# Altium schematic sheet display.SchDoc
size A4; SheetNumber: 1; SheetTotal: 1
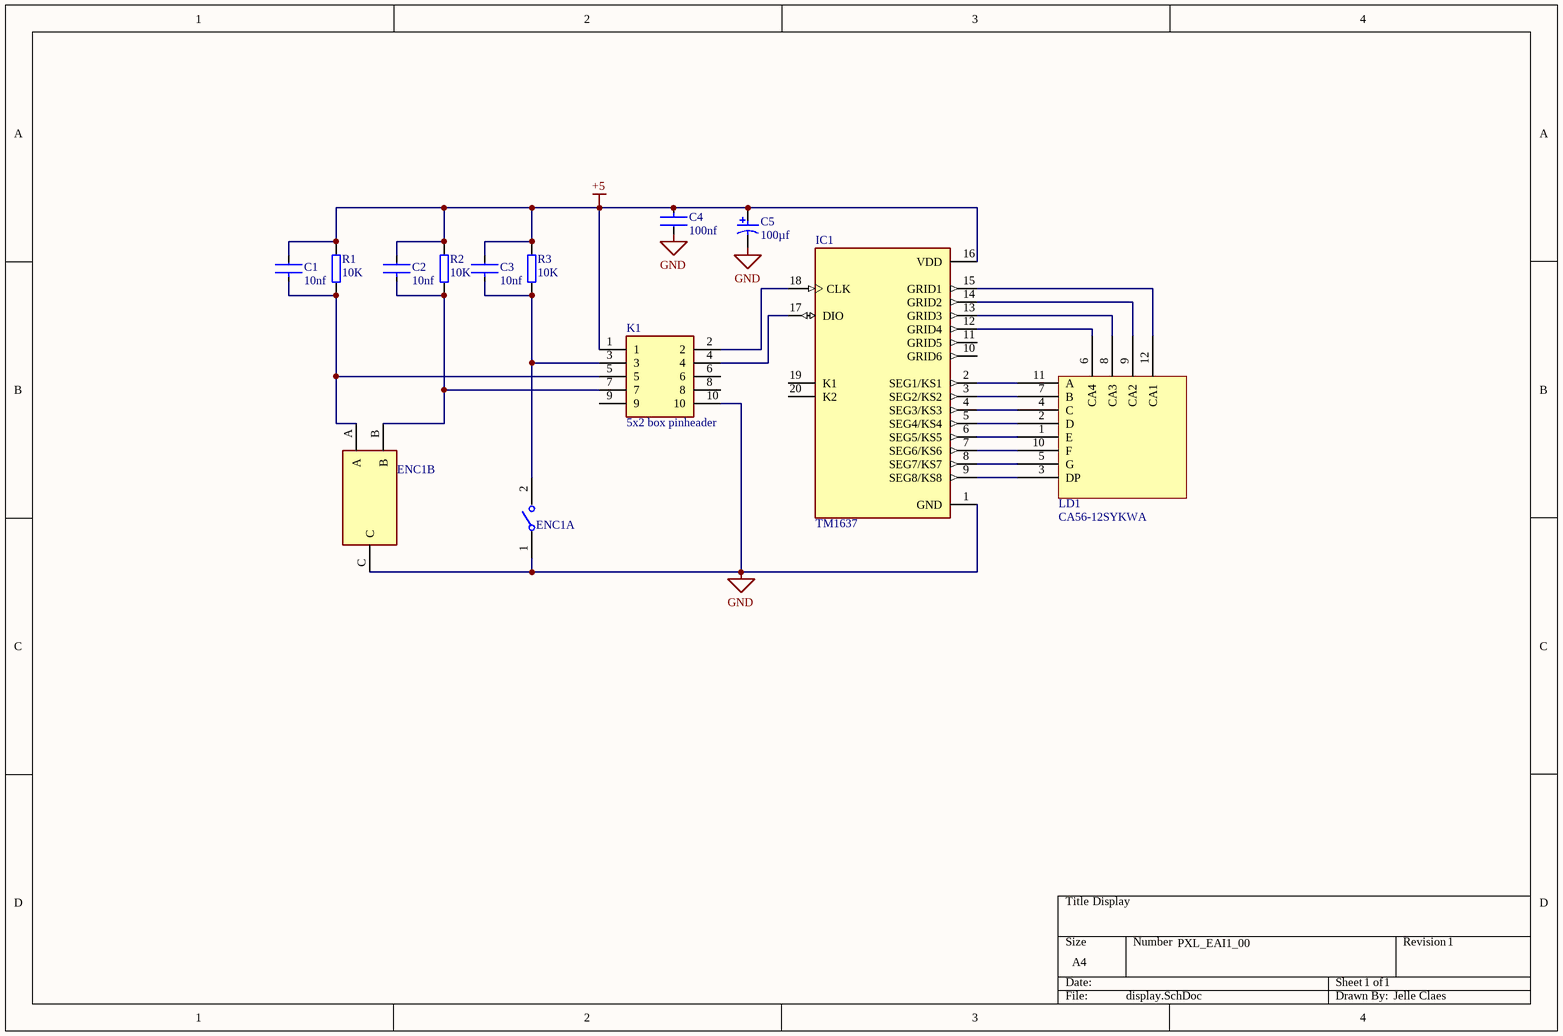
[diagram p0: display.SchDoc]

## Parts
C1  10nf  [CC_0805_m]
C2  10nf  [CC_0805_m]
C3  10nf  [CC_0805_m]
C4  100nf  [CC_0805_m]
C5  100µf  [CE_D8_L10]
ENC1  PEC11R-4220F-S0012  [PEC11R_4220F_S0012]  (value not drawn)  (parts A,B of 2)
IC1  TM1637  [SOP_20_M]
K1  5x2 box pinheader  [2x5 box pinheader]
LD1  CA56-12SYKWA  [LCD]
R1  10K  [R_0805_M]
R2  10K  [R_0805_M]
R3  10K  [R_0805_M]

## Nets
+5: C1.2 C2.2 C3.2 C4.1 C5.2 IC1.16(VDD) K1.1 R1.2 R2.2 R3.2
GND: C4.2 C5.1 ENC1.1 ENC1.C IC1.1(GND) K1.10
NetC1_1: C1.1 ENC1.A K1.5 R1.1
NetC2_1: C2.1 ENC1.B K1.7 R2.1
NetC3_1: C3.1 ENC1.2 K1.3 R3.1
NetIC1_2: IC1.2(SEG1/KS1) LD1.11(A)
NetIC1_3: IC1.3(SEG2/KS2) LD1.7(B)
NetIC1_4: IC1.4(SEG3/KS3) LD1.4(C)
NetIC1_5: IC1.5(SEG4/KS4) LD1.2(D)
NetIC1_6: IC1.6(SEG5/KS5) LD1.1(E)
NetIC1_7: IC1.7(SEG6/KS6) LD1.10(F)
NetIC1_8: IC1.8(SEG7/KS7) LD1.5(G)
NetIC1_9: IC1.9(SEG8/KS8) LD1.3(DP)
NetIC1_12: IC1.12(GRID4) LD1.6(CA4)
NetIC1_13: IC1.13(GRID3) LD1.8(CA3)
NetIC1_14: IC1.14(GRID2) LD1.9(CA2)
NetIC1_15: IC1.15(GRID1) LD1.12(CA1)
NetIC1_17: IC1.17(DIO) K1.4
NetIC1_18: IC1.18(CLK) K1.2

Not connected (* = marked no-connect by the designer): IC1 10(GRID6) 11(GRID5) 19(K1) 20(K2); K1 6 8 9

## Notes on the sheet
- Display
- PXL_EAI1_00
- 1
- Jelle Claes

## Library data of the parts
C1-C4 = Capacitor_Ceramic: Manufacturer: KEMET; Manufacturer Part Number: C0805C224K5RACTU; Value: 0.22 μF; Temperature Characteristic: X7R; Temperature Coefficient: 30ppm/°C; Tolerance: 0.1; Voltage Rating: 50 V; ComponentLink2URL: https://content.kemet.com/datasheets/KEM_C1003_C0G_SMD.pdf; Device Class L3: Ceramic Capacitors; Lead Free: Yes; Temperature: -55°C to +125°C; RoHS: TRUE; Capacitance: 0.22 μF; Automotive: No; Material: Ceramic; Octopart: https://octopart.com/c0805c224k5ractu-kemet-144670; Temperature Range Low: -55°C; Height: 0.88mm; Device Class L1: Passive Components; Digikey Description: CAP CER 0.22UF 50V X7R 0805; ComponentLink2Description: Datasheet; Mouser Description: CAP CER 0.22UF 50V X7R 0805; Category: Cap; Ipc Land Pattern Name: CAPC200125X78; Temperature Range High: +125°C; Package: C0805C-DN; Device Class L2: Capacitors
C5 = Capacitor_Electrolytic: Manufacturer: Panasonic; Voltage Rating: 25 V; ComponentLink2URL: http://industrial.panasonic.com/cdbs/www-data/pdf/RDE0000/ABA0000C1181.pdf; Height: 10.2 mm; Max Operating Temperature: 105 degC; PackageReference: EEE-FK1E221P; ComponentLink1Description: Manufacturer URL; ComponentLink1URL: http://www.panasonic.com/; Mount: Surface Mount; REACH SVHC: No SVHC; Min Operating Temperature: -55 degC; ComponentLink2Description: Datasheet; DatasheetVersion: 03/2016; Length: 10.2 mm; RoHSCompliant: true; Packaging: Tape and Reel; Package Quantity: 500; Lead Pitch: 3.1 mm; Pins: 2; PackageDescription: 2-Pin Electrolytic Aluminum Capacitor, Body 8.3 x 8.3 mm; Mounting Technology: Surface Mount
ENC1 = PEC11R-4220F-S0012: ROTARY ENCODER MECHANICAL 12PPR; Built in Switch: Yes; Number of Channels: 2; Output Type: Quadrature; Hole Diameter: 7mm; Pulses per Revolution: 12; Termination: PC Pin; Package Quantity: 150; RoHS Compliant: Yes; Mount: Through Hole; Width: 12.5mm; Radiation Hardening: No; Number of Pins: 5; REACH SVHC: No SVHC; Type: Mechanical; Packaging: Bulk; Min Operating Temperature: -30°C; Encoder Type: Mechanical; Height: 13.4mm; Length: 26.5mm; Orientation: Vertical; Max Operating Temperature: 70°C; Series: PEC11R; Detent: Yes
IC1 = TM1637: LED Drive Control Special Circuit; MF: Titan Micro Electronics; Package: Package; Availability: Not in stock; SnapEDA_Link: https://www.snapeda.com/parts/TM1637/Titan+Micro+Electronics/view-part/?ref=snap; MP: TM1637; Check_prices: https://www.snapeda.com/parts/TM1637/Titan+Micro+Electronics/view-part/?ref=eda; Value: *; Price: None
K1 = 5x2 box pinheader: Connector; Manufacturer_Name: Amphenol; Manufacturer_Part_Number: T821110A1S100CEU; Datasheet Link: https://docs.rs-online.com/e09c/0900766b81359cba.pdf; Height: 9.15mm; Mouser Part Number: N/A; Mouser Price/Stock: https://www.mouser.co.uk/ProductDetail/Amphenol/T821110A1S100CEU?qs=3IN%252Br8p6BrNf%2FuKCWm44Bg%3D%3D; Arrow Part Number: T821110A1S100CEU; Arrow Price/Stock: https://www.arrow.com/en/products/t821110a1s100ceu/amphenol-fci?region=europe
R1-R3 = Resistor: Manufacturer: Vishay Dale; Part Number: CRCW08050000Z0EA